# EasyEDA schematic sweet_spot_keyboard.json
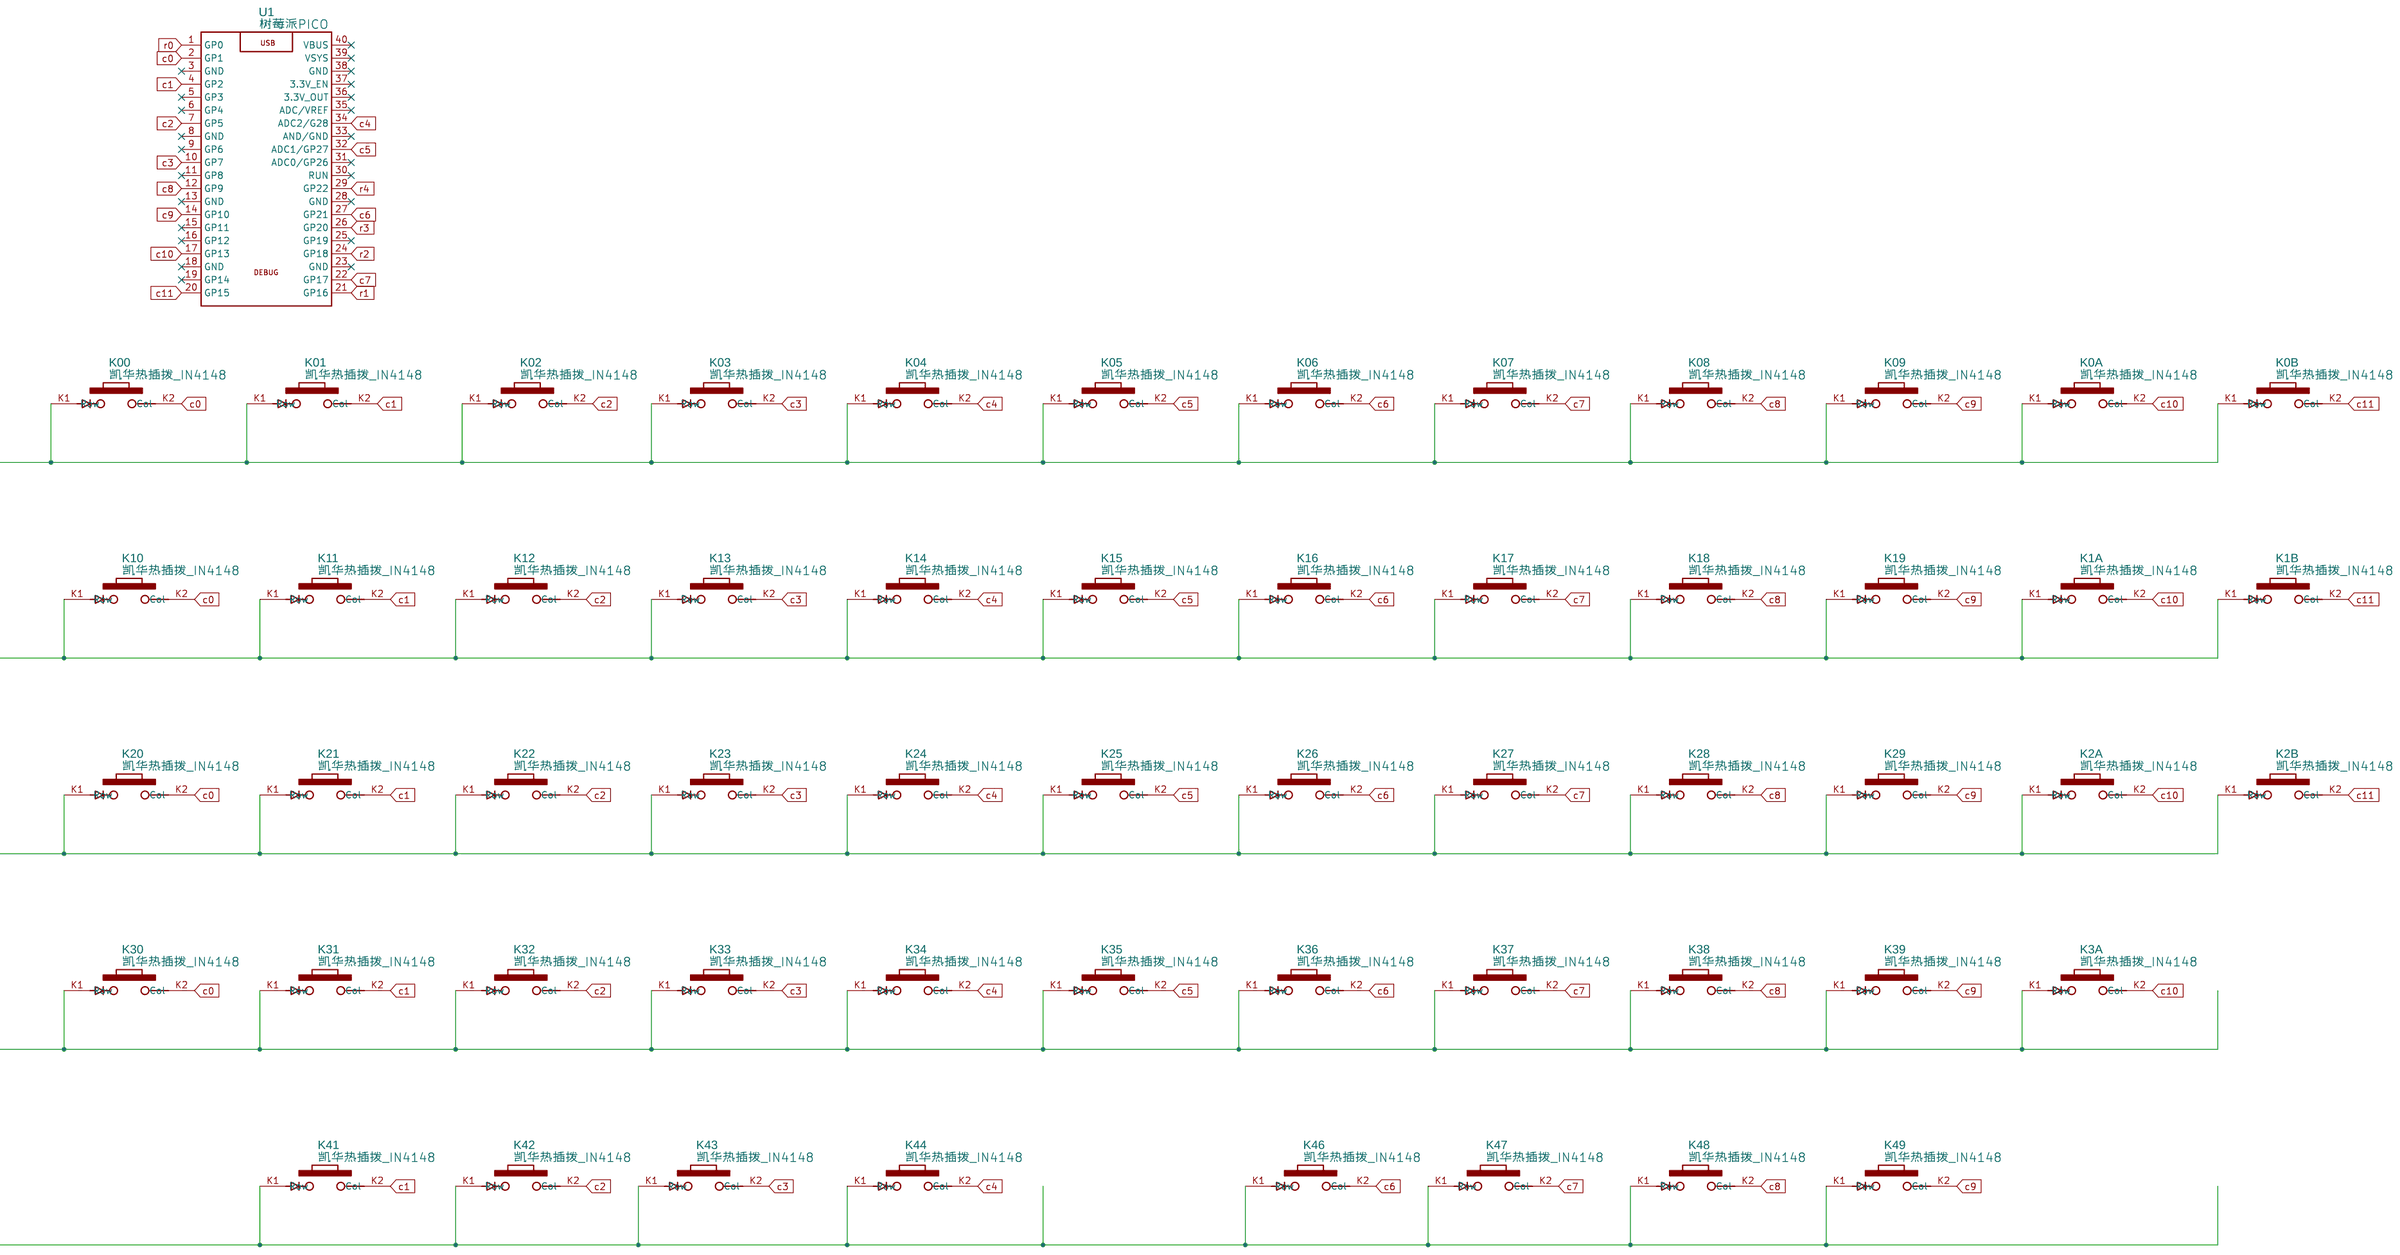
[diagram p0: schematic sheet]

## Parts
K00  凯华热插拨_IN4148  [凯华热插拨_IN4148]
K0A  凯华热插拨_IN4148  [凯华热插拨_IN4148]
K0B  凯华热插拨_IN4148  [凯华热插拨_IN4148]
K01  凯华热插拨_IN4148  [凯华热插拨_IN4148]
K1A  凯华热插拨_IN4148  [凯华热插拨_IN4148]
K1B  凯华热插拨_IN4148  [凯华热插拨_IN4148]
K02  凯华热插拨_IN4148  [凯华热插拨_IN4148]
K2A  凯华热插拨_IN4148  [凯华热插拨_IN4148]
K2B  凯华热插拨_IN4148  [凯华热插拨_IN4148]
K03  凯华热插拨_IN4148  [凯华热插拨_IN4148]
K3A  凯华热插拨_IN4148  [凯华热插拨_IN4148]
K04  凯华热插拨_IN4148  [凯华热插拨_IN4148]
K05  凯华热插拨_IN4148  [凯华热插拨_IN4148]
K06  凯华热插拨_IN4148  [凯华热插拨_IN4148]
K07  凯华热插拨_IN4148  [凯华热插拨_IN4148]
K08  凯华热插拨_IN4148  [凯华热插拨_IN4148]
K09  凯华热插拨_IN4148  [凯华热插拨_IN4148]
K10  凯华热插拨_IN4148  [凯华热插拨_IN4148]
K11  凯华热插拨_IN4148  [凯华热插拨_IN4148]
K12  凯华热插拨_IN4148  [凯华热插拨_IN4148]
K13  凯华热插拨_IN4148  [凯华热插拨_IN4148]
K14  凯华热插拨_IN4148  [凯华热插拨_IN4148]
K15  凯华热插拨_IN4148  [凯华热插拨_IN4148]
K16  凯华热插拨_IN4148  [凯华热插拨_IN4148]
K17  凯华热插拨_IN4148  [凯华热插拨_IN4148]
K18  凯华热插拨_IN4148  [凯华热插拨_IN4148]
K19  凯华热插拨_IN4148  [凯华热插拨_IN4148]
K20  凯华热插拨_IN4148  [凯华热插拨_IN4148]
K21  凯华热插拨_IN4148  [凯华热插拨_IN4148]
K22  凯华热插拨_IN4148  [凯华热插拨_IN4148]
K23  凯华热插拨_IN4148  [凯华热插拨_IN4148]
K24  凯华热插拨_IN4148  [凯华热插拨_IN4148]
K25  凯华热插拨_IN4148  [凯华热插拨_IN4148]
K26  凯华热插拨_IN4148  [凯华热插拨_IN4148]
K27  凯华热插拨_IN4148  [凯华热插拨_IN4148]
K28  凯华热插拨_IN4148  [凯华热插拨_IN4148]
K29  凯华热插拨_IN4148  [凯华热插拨_IN4148]
K30  凯华热插拨_IN4148  [凯华热插拨_IN4148]
K31  凯华热插拨_IN4148  [凯华热插拨_IN4148]
K32  凯华热插拨_IN4148  [凯华热插拨_IN4148]
K33  凯华热插拨_IN4148  [凯华热插拨_IN4148]
K34  凯华热插拨_IN4148  [凯华热插拨_IN4148]
K35  凯华热插拨_IN4148  [凯华热插拨_IN4148]
K36  凯华热插拨_IN4148  [凯华热插拨_IN4148]
K37  凯华热插拨_IN4148  [凯华热插拨_IN4148]
K38  凯华热插拨_IN4148  [凯华热插拨_IN4148]
K39  凯华热插拨_IN4148  [凯华热插拨_IN4148]
K41  凯华热插拨_IN4148  [凯华热插拨_IN4148]
K42  凯华热插拨_IN4148  [凯华热插拨_IN4148]
K43  凯华热插拨_IN4148  [凯华热插拨_IN4148]
K44  凯华热插拨_IN4148  [凯华热插拨_IN4148]
K46  凯华热插拨_IN4148  [凯华热插拨_IN4148]
K47  凯华热插拨_IN4148  [凯华热插拨_IN4148]
K48  凯华热插拨_IN4148  [凯华热插拨_IN4148]
K49  凯华热插拨_IN4148  [凯华热插拨_IN4148]
U1  树莓派PICO  [树莓派PICO]

## Library data of the parts
K00 K0A K0B K01 K1A K1B K02 K2A K2B K03 K3A K04 K05 K06 K07 K08 K09-K39 K41-K44 K46-K49 = 凯华热插拨_IN4148 COPY: Manufacturer: Kailh(凯华); Supplier Part: C400228; Contributor: Citiclzy
U1 = 树莓派PICO: Contributor: frost

## Nets
c0: K00.K2(Col) K10.K2(Col) K20.K2(Col) K30.K2(Col) U1.2(GP1)
c1: K01.K2(Col) K11.K2(Col) K21.K2(Col) K31.K2(Col) K41.K2(Col) U1.4(GP2)
c2: K02.K2(Col) K12.K2(Col) K22.K2(Col) K32.K2(Col) K42.K2(Col) U1.7(GP5)
c3: K03.K2(Col) K13.K2(Col) K23.K2(Col) K33.K2(Col) K43.K2(Col) U1.10(GP7)
c4: K04.K2(Col) K14.K2(Col) K24.K2(Col) K34.K2(Col) K44.K2(Col) U1.34(ADC2/G28)
c5: K05.K2(Col) K15.K2(Col) K25.K2(Col) K35.K2(Col) U1.32(ADC1/GP27)
c6: K06.K2(Col) K16.K2(Col) K26.K2(Col) K36.K2(Col) K46.K2(Col) U1.27(GP21)
c7: K07.K2(Col) K17.K2(Col) K27.K2(Col) K37.K2(Col) K47.K2(Col) U1.22(GP17)
c8: K08.K2(Col) K18.K2(Col) K28.K2(Col) K38.K2(Col) K48.K2(Col) U1.12(GP9)
c9: K09.K2(Col) K19.K2(Col) K29.K2(Col) K39.K2(Col) K49.K2(Col) U1.14(GP10)
c10: K0A.K2(Col) K1A.K2(Col) K2A.K2(Col) K3A.K2(Col) U1.17(GP13)
c11: K0B.K2(Col) K1B.K2(Col) K2B.K2(Col) U1.20(GP15)
r0: K00.K1(Row) K0A.K1(Row) K0B.K1(Row) K01.K1(Row) K02.K1(Row) K03.K1(Row) K04.K1(Row) K05.K1(Row) K06.K1(Row) K07.K1(Row) K08.K1(Row) K09.K1(Row) U1.1(GP0)
r1: K1A.K1(Row) K1B.K1(Row) K10.K1(Row) K11.K1(Row) K12.K1(Row) K13.K1(Row) K14.K1(Row) K15.K1(Row) K16.K1(Row) K17.K1(Row) K18.K1(Row) K19.K1(Row) U1.21(GP16)
r2: K2A.K1(Row) K2B.K1(Row) K20.K1(Row) K21.K1(Row) K22.K1(Row) K23.K1(Row) K24.K1(Row) K25.K1(Row) K26.K1(Row) K27.K1(Row) K28.K1(Row) K29.K1(Row) U1.24(GP18)
r3: K3A.K1(Row) K30.K1(Row) K31.K1(Row) K32.K1(Row) K33.K1(Row) K34.K1(Row) K35.K1(Row) K36.K1(Row) K37.K1(Row) K38.K1(Row) K39.K1(Row) U1.26(GP20)
r4: K41.K1(Row) K42.K1(Row) K43.K1(Row) K44.K1(Row) K46.K1(Row) K47.K1(Row) K48.K1(Row) K49.K1(Row) U1.29(GP22)

Not connected (* = marked no-connect by the designer): U1 3(GND)* 5(GP3)* 6(GP4)* 8(GND)* 9(GP6)* 11(GP8)* 13(GND)* 15(GP11)* 16(GP12)* 18(GND)* 19(GP14)* 23(GND)* 25(GP19)* 28(GND)* 30(RUN)* 31(ADC0/GP26)* 33(AND/GND)* 35(ADC/VREF)* 36(3.3V_OUT)* 37(3.3V_EN)* 38(GND)* 39(VSYS)* 40(VBUS)*
